# EAGLE design analog sequencer v3.1 (EAGLE 6.4)
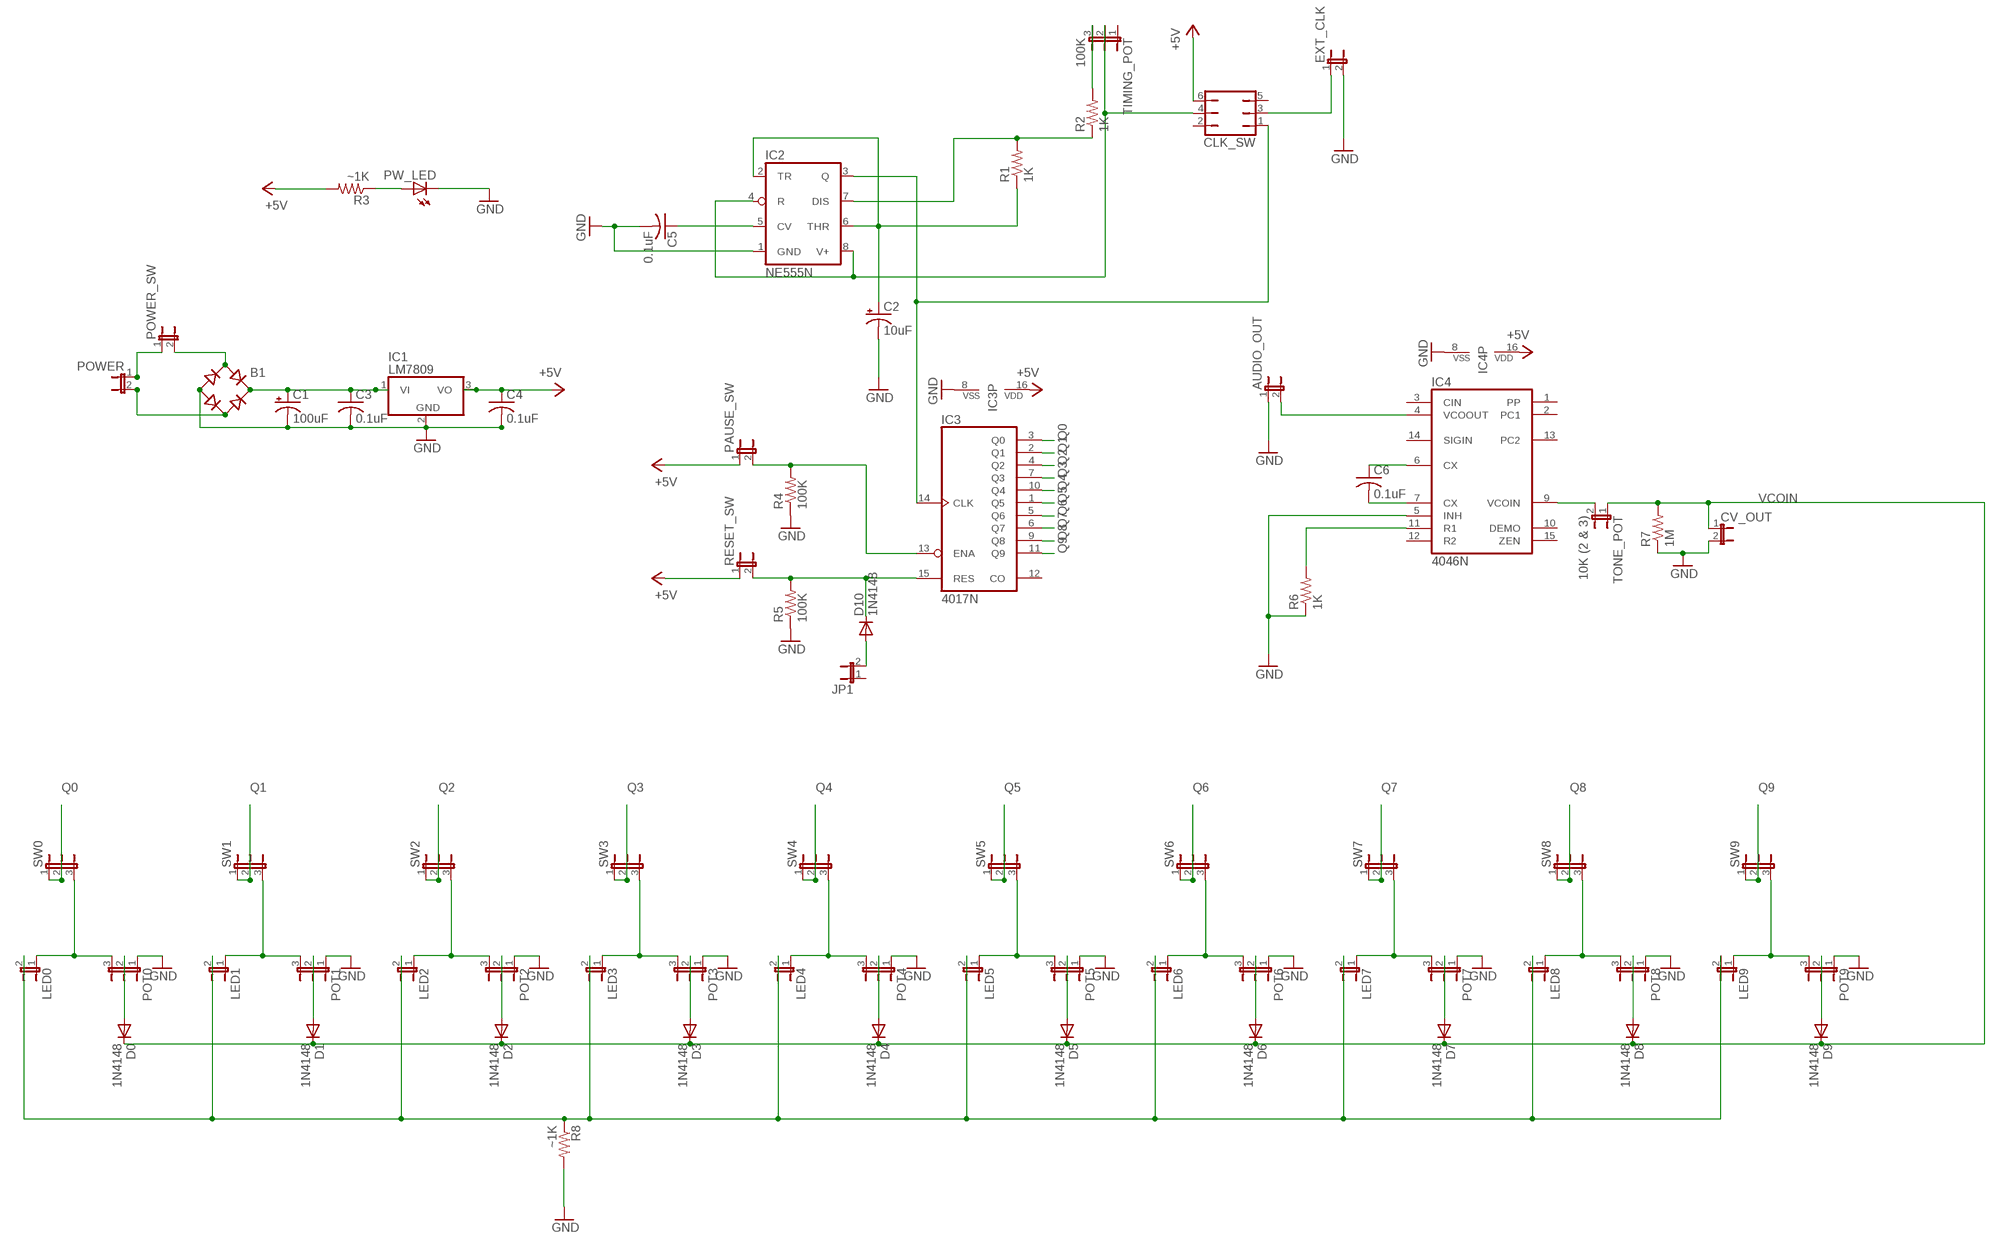
[diagram p0: schematic, sheet 1]

## Parts
AUDIO_OUT  JP1E  [JP1]
B1  RECTIFIER-RB1A  [RB1A]
C1  100uF  CPOL-USE2.5-5  [E2,5-5]
C2  10uF  CPOL-USE2.5-5  [E2,5-5]
C3  0.1uF  C-US025-025X050  [C025-025X050]
C4  0.1uF  C-US025-025X050  [C025-025X050]
C5  0.1uF  C-US025-025X050  [C025-025X050]
C6  0.1uF  C-US025-025X050  [C025-025X050]
CLK_SW  JP3Q  [JP3Q]
CV_OUT  JP1E  [JP1]
D0  1N4148  1N4148DO35-7  [DO35-7]
D1  1N4148  1N4148DO35-7  [DO35-7]
D2  1N4148  1N4148DO35-7  [DO35-7]
D3  1N4148  1N4148DO35-7  [DO35-7]
D4  1N4148  1N4148DO35-7  [DO35-7]
D5  1N4148  1N4148DO35-7  [DO35-7]
D6  1N4148  1N4148DO35-7  [DO35-7]
D7  1N4148  1N4148DO35-7  [DO35-7]
D8  1N4148  1N4148DO35-7  [DO35-7]
D9  1N4148  1N4148DO35-7  [DO35-7]
D10  1N4148  1N4148DO35-7  [DO35-7]
EXT_CLK  JP1E  [JP1]
IC1  LM7809  7805TV  [TO220V]
IC2  NE555N  [DIL08]
IC3  4017N  [DIL16]
IC4  4046N  [DIL16]
JP1  JP1E  [JP1]
LED0  JP1E  [JP1]
LED1  JP1E  [JP1]
LED2  JP1E  [JP1]
LED3  JP1E  [JP1]
LED4  JP1E  [JP1]
LED5  JP1E  [JP1]
LED6  JP1E  [JP1]
LED7  JP1E  [JP1]
LED8  JP1E  [JP1]
LED9  JP1E  [JP1]
PAUSE_SW  JP1E  [JP1]
POT0  JP2E  [JP2]
POT1  JP2E  [JP2]
POT2  JP2E  [JP2]
POT3  JP2E  [JP2]
POT4  JP2E  [JP2]
POT5  JP2E  [JP2]
POT6  JP2E  [JP2]
POT7  JP2E  [JP2]
POT8  JP2E  [JP2]
POT9  JP2E  [JP2]
POWER  JP1E  [JP1]
POWER_SW  JP1E  [JP1]
PW_LED  LED5MM  [LED5MM]
R1  1K  R-US_0204/7  [0204/7]
R2  1K  R-US_0204/7  [0204/7]
R3  ~1K  R-US_0204/7  [0204/7]
R4  100K  R-US_0204/7  [0204/7]
R5  100K  R-US_0204/7  [0204/7]
R6  1K  R-US_0204/7  [0204/7]
R7  1M  R-US_0204/7  [0204/7]
R8  ~1K  R-US_0204/7  [0204/7]
RESET_SW  JP1E  [JP1]
SW0  JP2E  [JP2]
SW1  JP2E  [JP2]
SW2  JP2E  [JP2]
SW3  JP2E  [JP2]
SW4  JP2E  [JP2]
SW5  JP2E  [JP2]
SW6  JP2E  [JP2]
SW7  JP2E  [JP2]
SW8  JP2E  [JP2]
SW9  JP2E  [JP2]
TIMING_POT  100K  JP2E  [JP2]
TONE_POT  10K (2 & 3)  JP1E  [JP1]

## Nets
+5V: C4.1 CLK_SW.6 IC1.3(VO) IC3.16(VDD) IC4.16(VDD) PAUSE_SW.1 R3.2 RESET_SW.1
GND: AUDIO_OUT.1 B1.- C1.- C2.- C3.2 C4.2 C5.2 CV_OUT.2 EXT_CLK.2 IC1.2(GND) IC2.1(GND) IC3.8(VSS) IC4.5(INH) IC4.8(VSS) POT0.1 POT1.1 POT2.1 POT3.1 POT4.1 POT5.1 POT6.1 POT7.1 POT8.1 POT9.1 PW_LED.K(C) R4.1 R5.1 R6.1 R7.1 R8.2
N$1: B1.AC2 POWER.2
N$2: B1.AC1 POWER_SW.2
N$3: POWER.1 POWER_SW.1
N$4: C5.1 IC2.5(CV)
N$5: CLK_SW.1 IC2.3(Q) IC3.14(CLK)
N$6: R2.2 TIMING_POT.3
N$7: B1.+ C1.+ C3.1 IC1.1(VI)
N$8: IC2.7(DIS) R1.2 R2.1
N$9: CLK_SW.4 IC2.4(R) IC2.8(V+) TIMING_POT.2
N$10: C2.+ IC2.2(TR) IC2.6(THR) R1.1
N$11: CLK_SW.3 EXT_CLK.1
N$12: LED0.1 POT0.3 SW0.3
N$13: LED1.1 POT1.3 SW1.3
N$14: LED2.1 POT2.3 SW2.3
N$15: LED3.1 POT3.3 SW3.3
N$16: LED4.1 POT4.3 SW4.3
N$17: LED5.1 POT5.3 SW5.3
N$18: LED6.1 POT6.3 SW6.3
N$19: LED7.1 POT7.3 SW7.3
N$20: LED8.1 POT8.3 SW8.3
N$21: LED9.1 POT9.3 SW9.3
N$22: IC3.13(ENA) PAUSE_SW.2 R4.2
N$23: LED0.2 LED1.2 LED2.2 LED3.2 LED4.2 LED5.2 LED6.2 LED7.2 LED8.2 LED9.2 R8.1
N$24: D10.A JP1.2
N$26: IC4.9(VCOIN) TONE_POT.2
N$28: D0.A POT0.2
N$29: D1.A POT1.2
N$30: D2.A POT2.2
N$31: D3.A POT3.2
N$32: D4.A POT4.2
N$33: D5.A POT5.2
N$34: D6.A POT6.2
N$35: D7.A POT7.2
N$36: D8.A POT8.2
N$37: D9.A POT9.2
N$45: C6.1 IC4.6(CX)
N$46: C6.2 IC4.7(CX)
N$48: IC4.11(R1) R6.2
N$49: AUDIO_OUT.2 IC4.4(VCOOUT)
N$50: PW_LED.A R3.1
Q0: IC3.3(Q0) SW0.1 SW0.2
Q1: IC3.2(Q1) SW1.1 SW1.2
Q2: IC3.4(Q2) SW2.1 SW2.2
Q3: IC3.7(Q3) SW3.1 SW3.2
Q4: IC3.10(Q4) SW4.1 SW4.2
Q5: IC3.1(Q5) SW5.1 SW5.2
Q6: IC3.5(Q6) SW6.1 SW6.2
Q7: IC3.6(Q7) SW7.1 SW7.2
Q8: IC3.9(Q8) SW8.1 SW8.2
Q9: IC3.11(Q9) SW9.1 SW9.2
RESET: D10.C IC3.15(RES) R5.2 RESET_SW.2
VCOIN: CV_OUT.1 D0.C D1.C D2.C D3.C D4.C D5.C D6.C D7.C D8.C D9.C R7.2 TONE_POT.1
Unconnected: CLK_SW.2 CLK_SW.5 IC3.12(CO) IC4.1(PP) IC4.2(PC1) IC4.3(CIN) IC4.10(DEMO) IC4.12(R2) IC4.13(PC2) IC4.14(SIGIN) IC4.15(ZEN) JP1.1 TIMING_POT.1

## Library data of the parts
AUDIO_OUT CV_OUT EXT_CLK JP1 LED0 LED1-LED9 PAUSE_SW POWER POWER_SW RESET_SW TONE_POT = jumper:JP1E: JUMPER
B1 = rectifier:RECTIFIER-: Rectifier
C1 C2 = rcl:CPOL-US: POLARIZED CAPACITOR, American symbol
C3-C6 = rcl:C-US: CAPACITOR, American symbol
CLK_SW = jumper:JP3Q: JUMPER
D0 D1-D10 = diode:1N4148: DIODE high speed (Philips)
IC1 = linear:78*: Positive VOLTAGE REGULATOR Source: http://cache.national.com/ds/LM/LM78L05.pdf http://www.fairchildsemi.com/ds/LM/LM7805.pdf
IC2 = linear:*555: TIMER
IC3 = 40xx:4017: COUNTER/DIVIDER
IC4 = 40xx:4046: Micropower PLL
POT0 POT1-POT9 SW0 SW1-SW9 TIMING_POT = jumper:JP2E: JUMPER
PW_LED = led:LED: LED OSRAM: - CHIPLED LG R971, LG N971, LY N971, LG Q971, LY Q971, LO R971, LY R971 LH N974, LH R974 LS Q976, LO Q976, LY Q976 LO Q996 - Hyper CHIPLED LW Q18S LB Q993, LB Q99A, LB R99A - SideLED LS A670, LO A670, LY A670, LG A670, LP A670 LB A673, LV A673, LT A673, LW A673 LH A674 LY A675 LS A676, LA A676, LO A676, LY A676, LW A676 LS A679, LY A679, LG A679 - Hyper Micro SIDELED® LS Y876, LA Y876, LO Y876, LY Y876 LT Y87S - SmartLED LW L88C, LW L88S LB L89C, LB L89S, LG L890 LS L89K, LO L89K, LY L89K LS L896, LA L896, LO L896, LY L896 - TOPLED LS T670, LO T670, LY T670, LG T670, LP T670 LSG T670, LSP T670, LSY T670, LOP T670, LYG T670 LG T671, LOG T671, LSG T671 LB T673, LV T673, LT T673, LW T673 LH T674 LS T676, LA T676, LO T676, LY T676, LB T676, LH T676, LSB T676, LW T676 LB T67C, LV T67C, LT T67C, LS T67K, LO T67K, LY T67K, LW E67C LS E67B, LA E67B, LO E67B, LY E67B, LB E67C, LV E67C, LT E67C LW T67C LS T679, LY T679, LG T679 LS T770, LO T770, LY T770, LG T770, LP T770 LB T773, LV T773, LT T773, LW T773 LH T774 LS E675, LA E675, LY E675, LS T675 LS T776, LA T776, LO T776, LY T776, LB T776 LHGB T686 LT T68C, LB T68C - Hyper Mini TOPLED® LB M676 - Mini TOPLED Santana® LG M470 LS M47K, LO M47K, LY M47K Source: http://www.osram.convergy.de LUXEON: - LUMILED® LXK2-PW12-R00, LXK2-PW12-S00, LXK2-PW14-U00, LXK2-PW14-V00 LXK2-PM12-R00, LXK2-PM12-S00, LXK2-PM14-U00 LXK2-PE12-Q00, LXK2-PE12-R00, LXK2-PE12-S00, LXK2-PE14-T00, LXK2-PE14-U00 LXK2-PB12-K00, LXK2-PB12-L00, LXK2-PB12-M00, LXK2-PB14-N00, LXK2-PB14-P00, LXK2-PB14-Q00 LXK2-PR12-L00, LXK2-PR12-M00, LXK2-PR14-Q00, LXK2-PR14-R00 LXK2-PD12-Q00, LXK2-PD12-R00, LXK2-PD12-S00 LXK2-PH12-R00, LXK2-PH12-S00 LXK2-PL12-P00, LXK2-PL12-Q00, LXK2-PL12-R00 Source: www.luxeon.com KINGBRIGHT: KA-3528ASYC Source: www.kingbright.com
R1-R8 = rcl:R-US_: RESISTOR, American symbol

## Net classes
0 default: width 0.127 mm

## Board
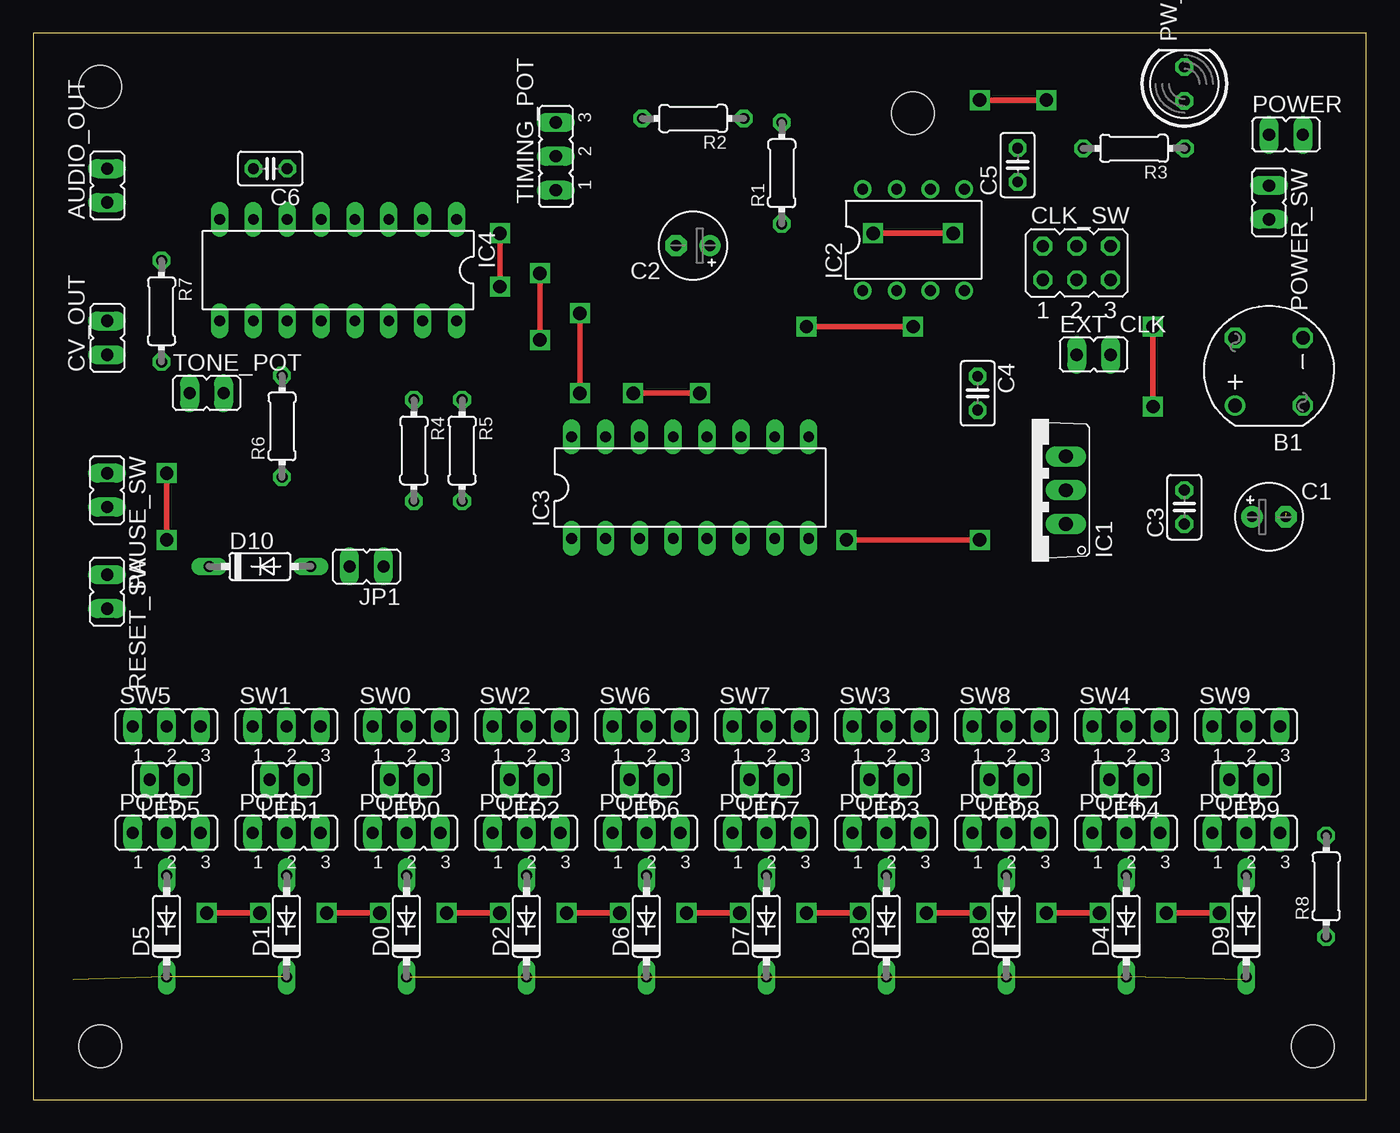
[diagram p1: board, top side]
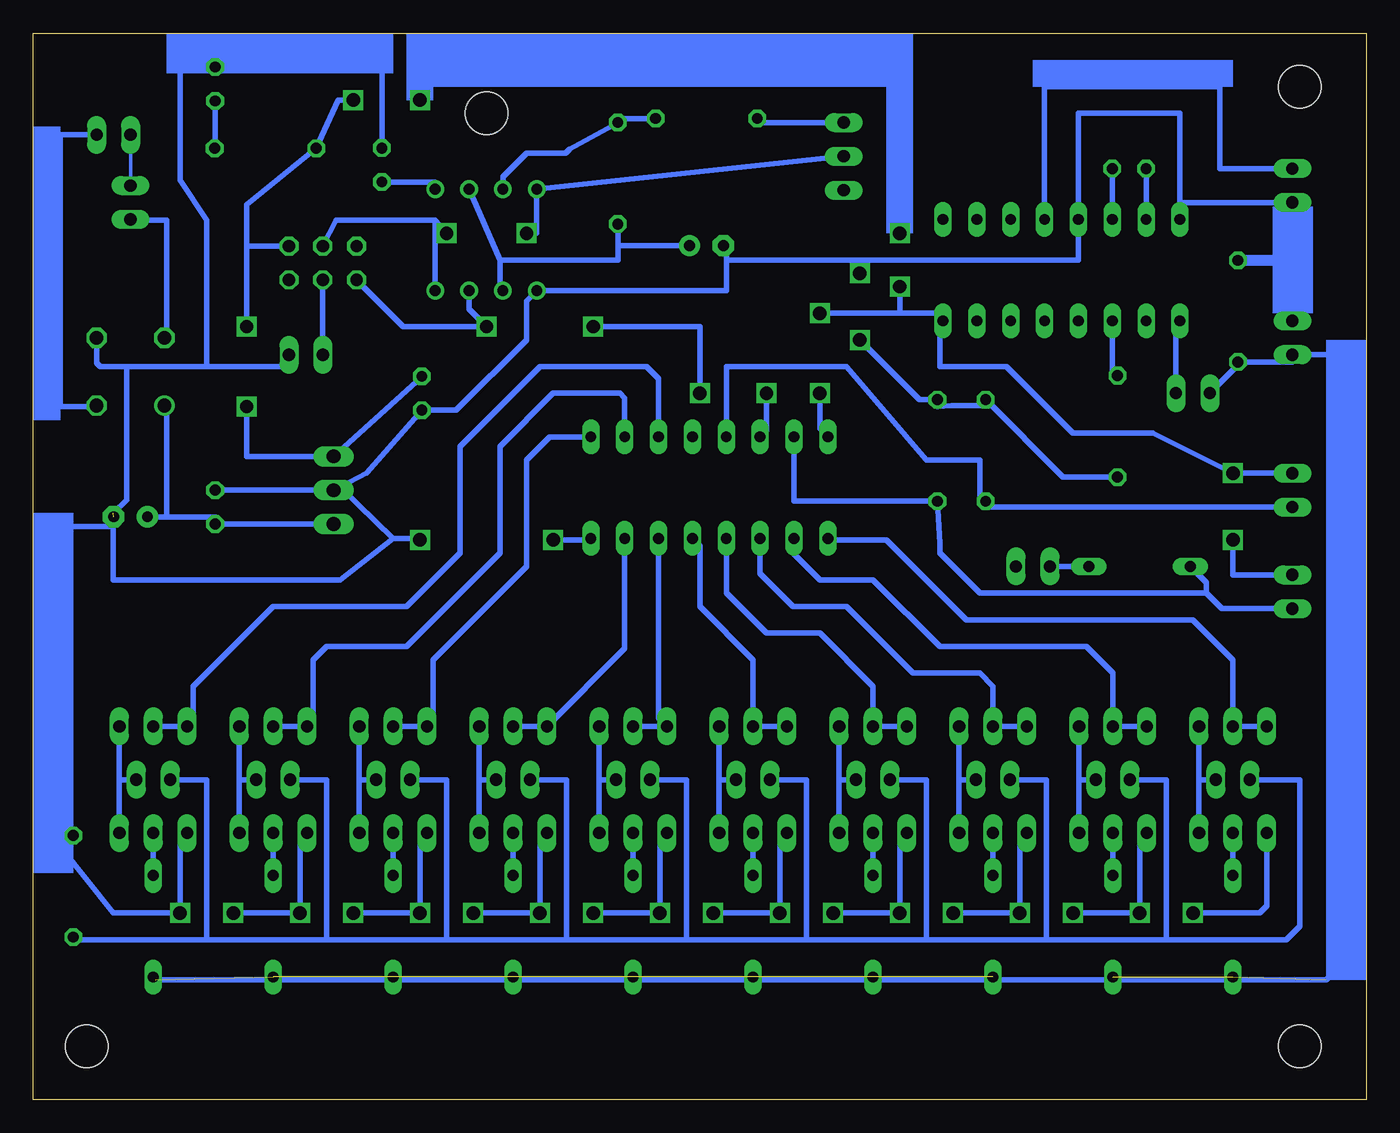
[diagram p2: board, bottom side, seen from below]

Size 100 x 80 mm. Coordinates in mm from the lower left corner, seen from the top.
Outline: 0,0 100,0 100,80 0,80 0,0
Copper layers (1*16): Top 0.035mm / dielectric 1.5mm / Bottom 0.035mm
Design rules "default *": minimum track width 10mil, minimum drill 24mil, track to track 8mil, track to pad 8mil, pad to pad 8mil, via to via 8mil, smd to smd 8mil, copper to edge 40mil, drill to drill 8mil, minimum pad ring 10mil, minimum via ring 8mil, stop-mask expansion 4mil, vias tented up to drill 0mil, thermal gap 10mil
Holes 3.2 mm at 5,76 5,4 96,4 66,74

### Footprints (pad centres in the part's own frame; a part is rotated, then mirrored left to right if it is on the bottom)
JP1 = drill 0.914 long: 1 0,-1.27; 2 0,1.27
RB1A = drill 1.016: + -2.54,2.54 | drill 1.016 octagon: - 2.54,-2.54; AC1 2.54,2.54; AC2 -2.54,-2.54
E2,5-5 = drill 0.813 pad 1.6: + -1.27,0 | drill 0.813 pad 1.6 octagon: - 1.27,0
C025-025X050 = drill 0.813 octagon: 1 -1.27,0; 2 1.27,0
JP3Q = drill 0.914 octagon: 1 -2.54,-1.27; 2 -2.54,1.27; 3 0,-1.27; 4 0,1.27; 5 2.54,-1.27; 6 2.54,1.27
DO35-7 = drill 0.813 long: A 3.81,0; C -3.81,0
TO220V = drill 1.016 long: 1 -2.54,-2.54; 2 0,-2.54; 3 2.54,-2.54
DIL08 = drill 0.813 pad 1.27: 1 -3.81,-3.81; 2 -1.27,-3.81; 3 1.27,-3.81; 4 3.81,-3.81; 5 3.81,3.81; 6 1.27,3.81; 7 -1.27,3.81; 8 -3.81,3.81
DIL16 = drill 0.813 long: 1 -8.89,-3.81; 2 -6.35,-3.81; 3 -3.81,-3.81; 4 -1.27,-3.81; 5 1.27,-3.81; 6 3.81,-3.81; 7 6.35,-3.81; 8 8.89,-3.81; 9 8.89,3.81; 10 6.35,3.81; 11 3.81,3.81; 12 1.27,3.81; 13 -1.27,3.81; 14 -3.81,3.81; 15 -6.35,3.81; 16 -8.89,3.81
JP2 = drill 0.914 long: 1 -2.54,0; 2 0,0; 3 2.54,0
LED5MM = drill 0.813 octagon: A -1.27,0; K 1.27,0
0204/7 = drill 0.813 octagon: 1 -3.81,0; 2 3.81,0

### Placement (x,y rotation side)
AUDIO_OUT  5.54,68.58 0 top
B1  92.71,54.61 90 top
C1  92.71,43.72 0 top
C2  49.5,64.07 180 top
C3  86.36,44.45 90 top
C4  70.85,52.99 270 top
C5  73.85,70.12 90 top
C6  17.78,69.85 180 top
CLK_SW  78.28,62.77 0 top
CV_OUT  5.54,57.15 0 top
D0  28,13 90 top
D1  19,13 90 top
D2  37,13 90 top
D3  64,13 90 top
D4  82,13 90 top
D5  10,13 90 top
D6  46,13 90 top
D7  55,13 90 top
D8  73,13 90 top
D9  91,13 90 top
D10  17,40 0 top
EXT_CLK  79.55,55.88 270 top
IC1  74.93,45.72 90 top
IC2  66.04,64.5 0 top
IC3  49.28,45.91 0 top
IC4  22.86,62.23 180 top
JP1  25,40 90 top
LED0  28,24 90 top
LED1  19,24 90 top
LED2  37,24 90 top
LED3  64,24 90 top
LED4  82,24 90 top
LED5  10,24 90 top
LED6  46,24 90 top
LED7  55,24 90 top
LED8  73,24 90 top
LED9  91,24 90 top
PAUSE_SW  5.54,45.72 180 top
POT0  28,20 0 top
POT1  19,20 0 top
POT2  37,20 0 top
POT3  64,20 0 top
POT4  82,20 0 top
POT5  10,20 0 top
POT6  46,20 0 top
POT7  55,20 0 top
POT8  73,20 0 top
POT9  91,20 0 top
POWER  93.98,72.39 270 top
POWER_SW  92.71,67.31 180 top
PW_LED  86.36,76.2 90 top
R1  56.15,69.5 90 top
R2  49.5,73.61 180 top
R3  82.58,71.37 180 top
R4  28.55,48.7 270 top
R5  32.17,48.7 270 top
R6  18.66,50.51 90 top
R7  9.62,59.15 270 top
R8  97,16 90 top
RESET_SW  5.54,38.1 180 top
SW0  28,28 0 top
SW1  19,28 0 top
SW2  37,28 0 top
SW3  64,28 0 top
SW4  82,28 0 top
SW5  10,28 0 top
SW6  46,28 0 top
SW7  55,28 0 top
SW8  73,28 0 top
SW9  91,28 0 top
TIMING_POT  39.2,70.77 90 top
TONE_POT  13,53 270 top

### Tracks (layer width: path | path; a pad name or v marks a point on that pad's centre or on a via)
+5V  (via drill 0.6, 0.7, 1)
  Top 0.406: v35,65 v35,61 | v76,75 v71,75 | v84,52 v84,58 | v10,47 v10,42 | v41,53 v41,59
  Bottom 0.406: v35,65 35,78 71,78 v71,75 | v76,75 77.14,75 R3.2 84,67.14 84,64 | C4.1 IC1.3 84,48.26 v84,52 | v84,58 84,64 | CLK_SW.6 83.96,64.04 84,64 | PAUSE_SW.1 v10,47 16,50 22,50 27,55 32,55 32,58.17 IC4.16 32.33,59 35,59 | v10,42 10,39.37 RESET_SW.1 | IC3.16 41,50.33 v41,53 | v41,59 35,59 | 35,59 v35,61
GND  (via drill 1)  (1 unrouted)
  Top 0.406: v38,57 v38,62 | v61,42 v71,42 | v13,14 v17,14 | v22,14 v26,14 | v31,14 v35,14 | v40,14 v44,14 | v49,14 v53,14 | v58,14 v62,14 | v67,14 v71,14 | v76,14 v80,14 | v85,14 v89,14
  Bottom 0.254: 28.48,52.07 R4.1
  Bottom 0.406: C3.2 IC1.2 | CV_OUT.2 5.54,63 AUDIO_OUT.1 13.97,67.31 IC4.8 13.97,74 21.59,74 IC4.5 21.59,63 38,63 | C2.- 48,63.77 48,63 | EXT_CLK.2 80.7,55 87,55 | 87,55 93,55 | 93,55 95,55 95.25,55.25 B1.- | 87,55 87,66 89,69 89,77.47 PW_LED.K 73.85,77.47 C5.2 | 73,42.1 77,39 94,39 94,44 93,45 93,55 | 48,63 48,60.69 IC2.1 63,59.92 63,57 68.28,51.72 C4.2 75,47 76.98,45.97 | R6.1 22.74,46.7 R4.1 | 38,63 48,63 | v38,62 38,63 | 76.28,45.72 IC1.2 | 76.98,45.97 IC1.2 | 73,42.1 76.98,45.97 | POT7.1 53,19.46 v53,14 v58,14 | 28.48,52.07 31.1,52.07 32.17,52 R5.1 33.51,52.51 v38,57 | IC3.8 58.27,42 v61,42 | v71,42 71.1,42.1 73,42.1 | R8.2 98,19.81 | 98,19.81 98,43 93.98,43 C1.- | POT5.1 7.46,14.54 8,14 v13,14 | v22,14 v17,14 17,19.46 POT1.1 | v31,14 v26,14 26,19.46 POT0.1 | v40,14 v35,14 35,19.46 POT2.1 | v49,14 v44,14 44,19.46 POT6.1 | v67,14 v62,14 62,19.46 POT3.1 | v76,14 v71,14 71,19.46 POT8.1 | v85,14 v80,14 80,19.46 POT4.1 | 98,19.81 98,19 94,14 v89,14 89,19.46 POT9.1
  Bottom 0.813: R7.1 9.62,63 5.54,63
N$1
  Bottom 0.406: B1.AC2 95.25,52 98,52 98,72.39 POWER.2
N$2
  Bottom 0.406: POWER_SW.2 92.71,66 90,66 90,57.15 B1.AC1
N$3
  Bottom 0.254: POWER.1 POWER_SW.1
N$4
  Bottom 0.406: C5.1 69.85,68.85 IC2.5
N$5  (via drill 1)
  Top 0.406: v45,53 v50,53 | v58,58 v66,58
  Bottom 0.406: IC3.14 45,50.19 v45,53 | v50,53 50,58 v58,58 | IC2.3 67.31,59.31 v66,58 72.24,58 CLK_SW.1
N$6
  Bottom 0.406: R2.2 45.39,73.31 TIMING_POT.3
N$7
  Bottom 0.406: C1.+ 90,43.72 | 90,43.72 86.36,43.72 C3.1 IC1.1 | B1.+ 90,52.07 90,43.72
N$8
  Bottom 0.406: R2.1 56.15,73.61 R1.2 59.77,71.31 60.08,71 63,71 64.77,69.23 IC2.7
N$9  (via drill 1)
  Top 0.406: v63,65 v69,65
  Bottom 0.406: CLK_SW.4 77.28,66 69.85,66 | v63,65 62.23,65 IC2.8 TIMING_POT.2 | v69,65 69.85,66 | 69.85,66 IC2.4
N$10
  Bottom 0.406: 65,61 IC2.2 64.77,60.77 65,61 | IC2.6 65,63 | 65,63 65,61 | R1.1 56.15,64.07 | 65,63 56.15,63 56.15,64 56.15,64.07 | C2.+ 56.15,64.07
N$11
  Bottom 0.406: EXT_CLK.1 CLK_SW.3
N$12
  Bottom 0.406: SW0.3 30.54,24 | 30.54,24 POT0.3 | LED0.1 30.54,24
N$13
  Bottom 0.406: SW1.3 21.54,24 | 21.54,24 POT1.3 | LED1.1 21.54,24
N$14
  Bottom 0.406: SW2.3 39.54,24 | 39.54,24 POT2.3 | LED2.1 39.54,24
N$15
  Bottom 0.406: SW3.3 66.54,24 | 66.54,24 POT3.3 | LED3.1 66.54,24
N$16
  Bottom 0.406: SW4.3 84.54,24 | 84.54,24 POT4.3 | LED4.1 84.54,24
N$17
  Bottom 0.406: SW5.3 12.54,24 | 12.54,24 POT5.3 | LED5.1 12.54,24
N$18
  Bottom 0.406: SW6.3 48.54,24 | 48.54,24 POT6.3 | LED6.1 48.54,24
N$19
  Bottom 0.406: SW7.3 57.54,24 | 57.54,24 POT7.3 | LED7.1 57.54,24
N$20
  Bottom 0.406: SW8.3 75.54,24 | 75.54,24 POT8.3 | LED8.1 75.54,24
N$21
  Bottom 0.406: SW9.3 93.54,24 | 93.54,24 POT9.3 | LED9.1 93.54,24
N$22
  Bottom 0.406: PAUSE_SW.2 28.55,44.45 R4.2 29,44.89 29,48 33,48 39,55 48,55 48.01,54.99 IC3.13
N$23
  Bottom 0.406: LED5.2 5,24 5,13 6,12 15,12 | 15,12 24,12 | 24,12 33,12 | 33,12 42,12 | 42,12 51,12 | 51,12 60,12 | 60,12 69,12 | 69,12 78,12 | 78,12 87,12 | 87,12 97,12 R8.1 | LED1.2 15,24 15,12 | LED0.2 24,24 24,12 | LED2.2 33,24 33,12 | LED6.2 42,24 42,12 | LED7.2 51,24 51,12 | LED3.2 60,24 60,12 | LED8.2 69,24 69,12 | LED4.2 78,24 78,12 | LED9.2 87,24 87,12
N$24
  Bottom 0.406: D10.A JP1.2
N$26
  Bottom 0.406: TONE_POT.2 14.27,58.12 IC4.9
N$28
  Bottom 0.406: POT0.2 D0.A
N$29
  Bottom 0.406: POT1.2 D1.A
N$30
  Bottom 0.406: POT2.2 D2.A
N$31
  Bottom 0.406: POT3.2 D3.A
N$32
  Bottom 0.406: POT4.2 D4.A
N$33
  Bottom 0.406: POT5.2 D5.A
N$34
  Bottom 0.406: POT6.2 D6.A
N$35
  Bottom 0.406: POT7.2 D7.A
N$36
  Bottom 0.406: POT8.2 D8.A
N$37
  Bottom 0.406: POT9.2 D9.A
N$45
  Bottom 0.406: C6.1 IC4.6
N$46
  Bottom 0.406: C6.2 IC4.7
N$48
  Bottom 0.406: R6.2 19.05,54.32 IC4.11
N$49
  Bottom 0.406: IC4.4 24.13,76 11,76 11,69.85 AUDIO_OUT.2
N$50
  Bottom 0.406: PW_LED.A 86.36,71.37 R3.1
Q0
  Bottom 0.406: SW0.1 SW0.2 28,31 29,32 34,32 39,37 43,37 45.47,39.47 IC3.3
Q1
  Bottom 0.406: SW1.1 SW1.2 19,32 21,34 32,34 37,39 41,39 42.93,40.93 IC3.2
Q2
  Bottom 0.406: SW2.1 SW2.2 37,31 41,35 45,35 48,38 IC3.4
Q3
  Bottom 0.406: SW3.2 SW3.1 55.63,33.83 IC3.7
Q4
  Bottom 0.406: SW4.2 SW4.1 79,28.46 79,33 78,34 72,34 65,41 65,49 61,53 56,53 55.63,52.63 IC3.10
Q5
  Bottom 0.406: SW5.1 SW5.2 10,33 13,36 30,36 36,42 40.29,42 IC3.1
Q6
  Bottom 0.406: SW6.1 SW6.2 46,33 50,37 50,41.55 IC3.5
Q7
  Bottom 0.406: SW7.2 SW7.1 53.09,28.63 IC3.6
Q8
  Bottom 0.406: SW8.2 SW8.1 70,28.46 70,33 63,40 63,48 61.28,49.72 IC3.9
Q9
  Bottom 0.406: SW9.2 SW9.1 88,28.46 88,31 82,37 72,37 68,41 68,49 62,55 54,55 53.09,54.09 IC3.11
RESET
  Bottom 0.406: 12,38 29,38 32,41 32,41.72 R5.2 42.93,44.89 IC3.15 | RESET_SW.2 10.83,36.83 12,38 | 12,38 12,38.81 D10.C
VCOIN  (9 unrouted)
  Bottom 0.406: TONE_POT.1 9.62,55.11 R7.2 5.54,55.34 CV_OUT.1 2.12,55.88 2,56 2,10 3,9 90.81,9 D9.C
(copper drawn outside any net)
  shapes: Bottom area x11